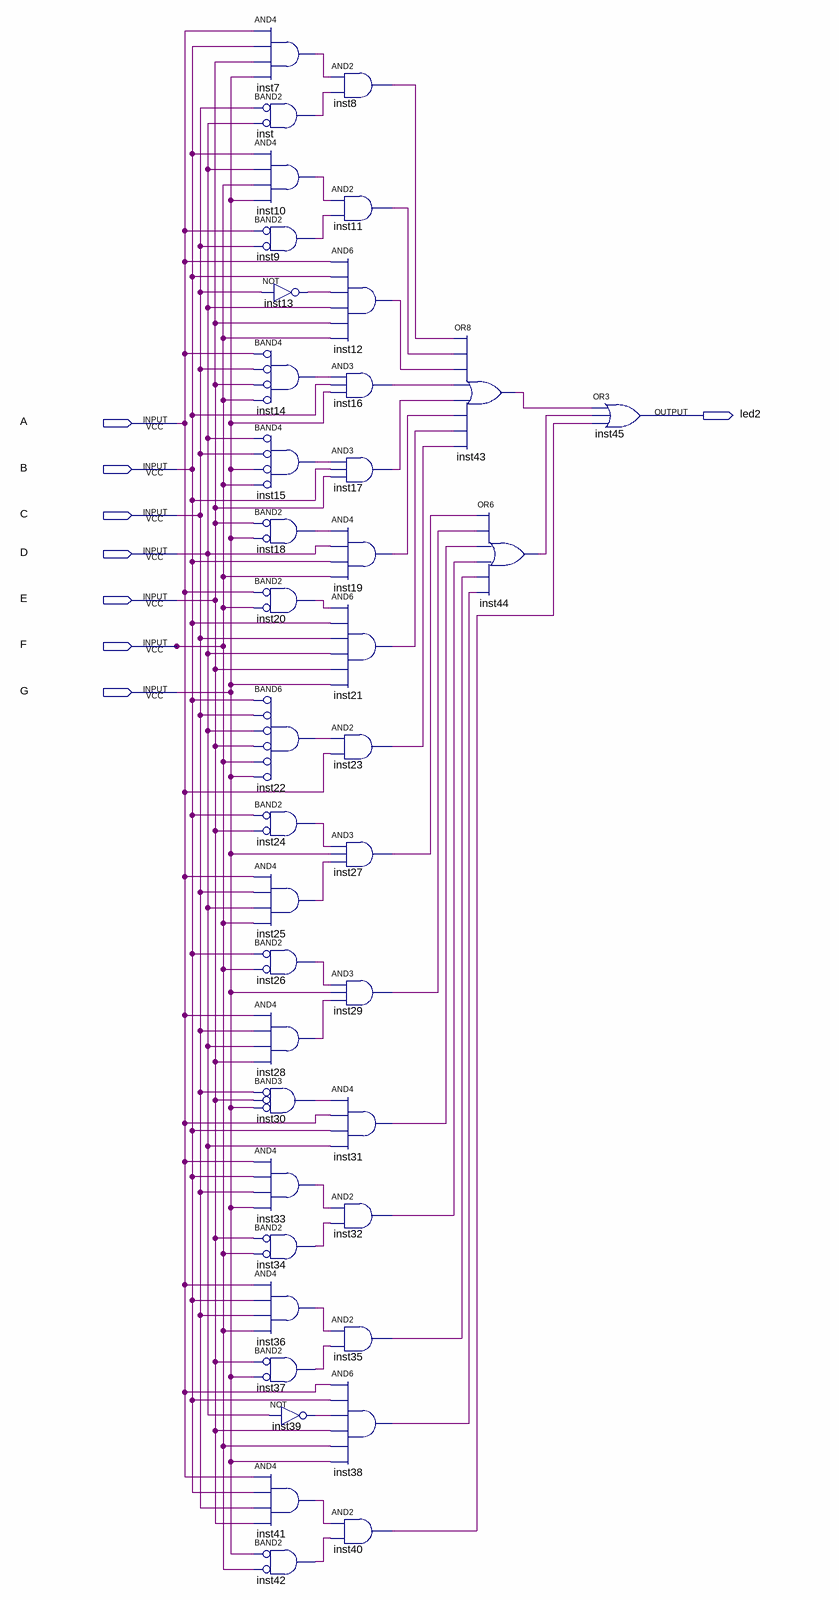
[diagram p0: schematic sheet]
// Quartus schematic LED2.bdf as structural Verilog: 40 symbols, 8 pins
module LED2 (
  input  A,
  input  B,
  input  C,
  input  D,
  input  E,
  input  F,
  input  G,
  output led2
);

  wire inst7_out, inst8_out, inst9_out, inst10_out, inst11_out, inst12_out, inst13_out, inst14_out,
       inst15_out, inst16_out, inst17_out, inst18_out, inst19_out, inst20_out, inst21_out, inst22_out,
       inst23_out, inst24_out, inst25_out, inst26_out, inst27_out, inst28_out, inst29_out, inst30_out,
       inst31_out, inst32_out, inst33_out, inst34_out, inst35_out, inst36_out, inst37_out, inst38_out,
       inst39_out, inst40_out, inst41_out, inst42_out, inst43_out, inst44_out, inst_out;

  and inst7 (inst7_out, A, B, E, G);
  and inst (inst_out, ~C, ~D);  // BAND2
  and inst10 (inst10_out, B, D, F, G);
  and inst9 (inst9_out, ~A, ~C);  // BAND2
  not inst13 (inst13_out, C);
  and inst14 (inst14_out, ~A, ~C, ~E, ~F);  // BAND4
  and inst15 (inst15_out, ~D, ~C, ~G, ~F);  // BAND4
  and inst18 (inst18_out, ~E, ~G);  // BAND2
  and inst20 (inst20_out, ~A, ~F);  // BAND2
  and inst22 (inst22_out, ~B, ~C, ~D, ~E, ~F, ~G);  // BAND6
  and inst24 (inst24_out, ~B, ~E);  // BAND2
  and inst25 (inst25_out, A, C, D, F);
  and inst26 (inst26_out, ~B, ~F);  // BAND2
  and inst28 (inst28_out, A, C, D, E);
  and inst30 (inst30_out, ~C, ~E, ~G);  // BAND3
  and inst33 (inst33_out, A, B, C, G);
  and inst34 (inst34_out, ~E, ~F);  // BAND2
  and inst36 (inst36_out, A, B, C, F);
  and inst37 (inst37_out, ~E, ~G);  // BAND2
  not inst39 (inst39_out, D);
  and inst41 (inst41_out, A, B, C, E);
  and inst42 (inst42_out, ~G, ~F);  // BAND2
  and inst8 (inst8_out, inst7_out, inst_out);
  and inst11 (inst11_out, inst10_out, inst9_out);
  and inst12 (inst12_out, A, B, inst13_out, D, E, F);
  and inst16 (inst16_out, inst14_out, B, G);
  and inst17 (inst17_out, inst15_out, B, E);
  and inst19 (inst19_out, inst18_out, D, B, F);
  and inst21 (inst21_out, inst20_out, B, C, D, E, G);
  and inst23 (inst23_out, inst22_out, A);
  and inst27 (inst27_out, inst24_out, G, inst25_out);
  and inst29 (inst29_out, inst26_out, G, inst28_out);
  and inst31 (inst31_out, inst30_out, A, B, D);
  and inst32 (inst32_out, inst33_out, inst34_out);
  and inst35 (inst35_out, inst36_out, inst37_out);
  and inst38 (inst38_out, A, B, inst39_out, E, F, G);
  and inst40 (inst40_out, inst41_out, inst42_out);
  or inst43 (inst43_out, inst8_out, inst11_out, inst12_out, inst16_out, inst17_out, inst19_out, inst21_out, inst23_out);
  or inst44 (inst44_out, inst27_out, inst29_out, inst31_out, inst32_out, inst35_out, inst38_out);
  or inst45 (led2, inst43_out, inst44_out, inst40_out);
endmodule
